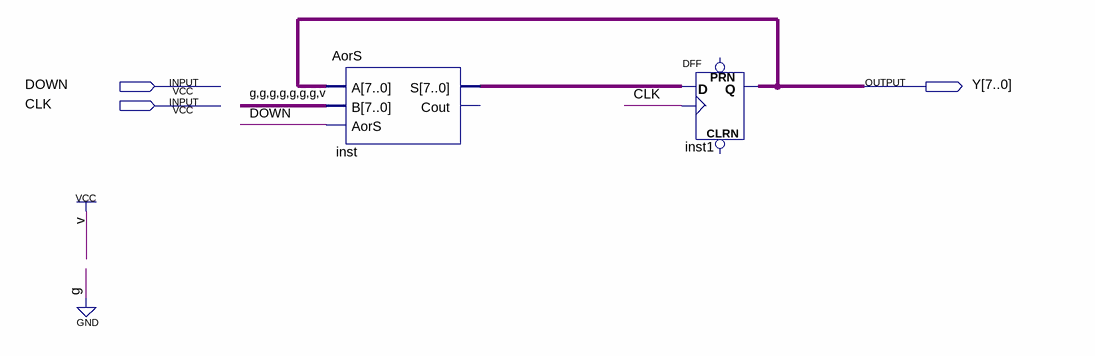
[diagram p0: schematic sheet]
// Quartus schematic counter.bdf as structural Verilog: 2 symbols, 3 pins
module counter (
  input  DOWN,
  input  CLK,
  output [7:0] Y
);

  wire [7:0] inst_s;

  AorS inst (.A(Y), .B(8'b00000001), .AorS(DOWN), .S(inst_s));  // open: Cout
  DFF inst1[7:0] (.CLK(CLK), .D(inst_s), .Q(Y));  // open: CLRN, PRN
endmodule
